# EAGLE design AMS Test Board rev2 (EAGLE 9.6.2)

## Sheet 1 of 2
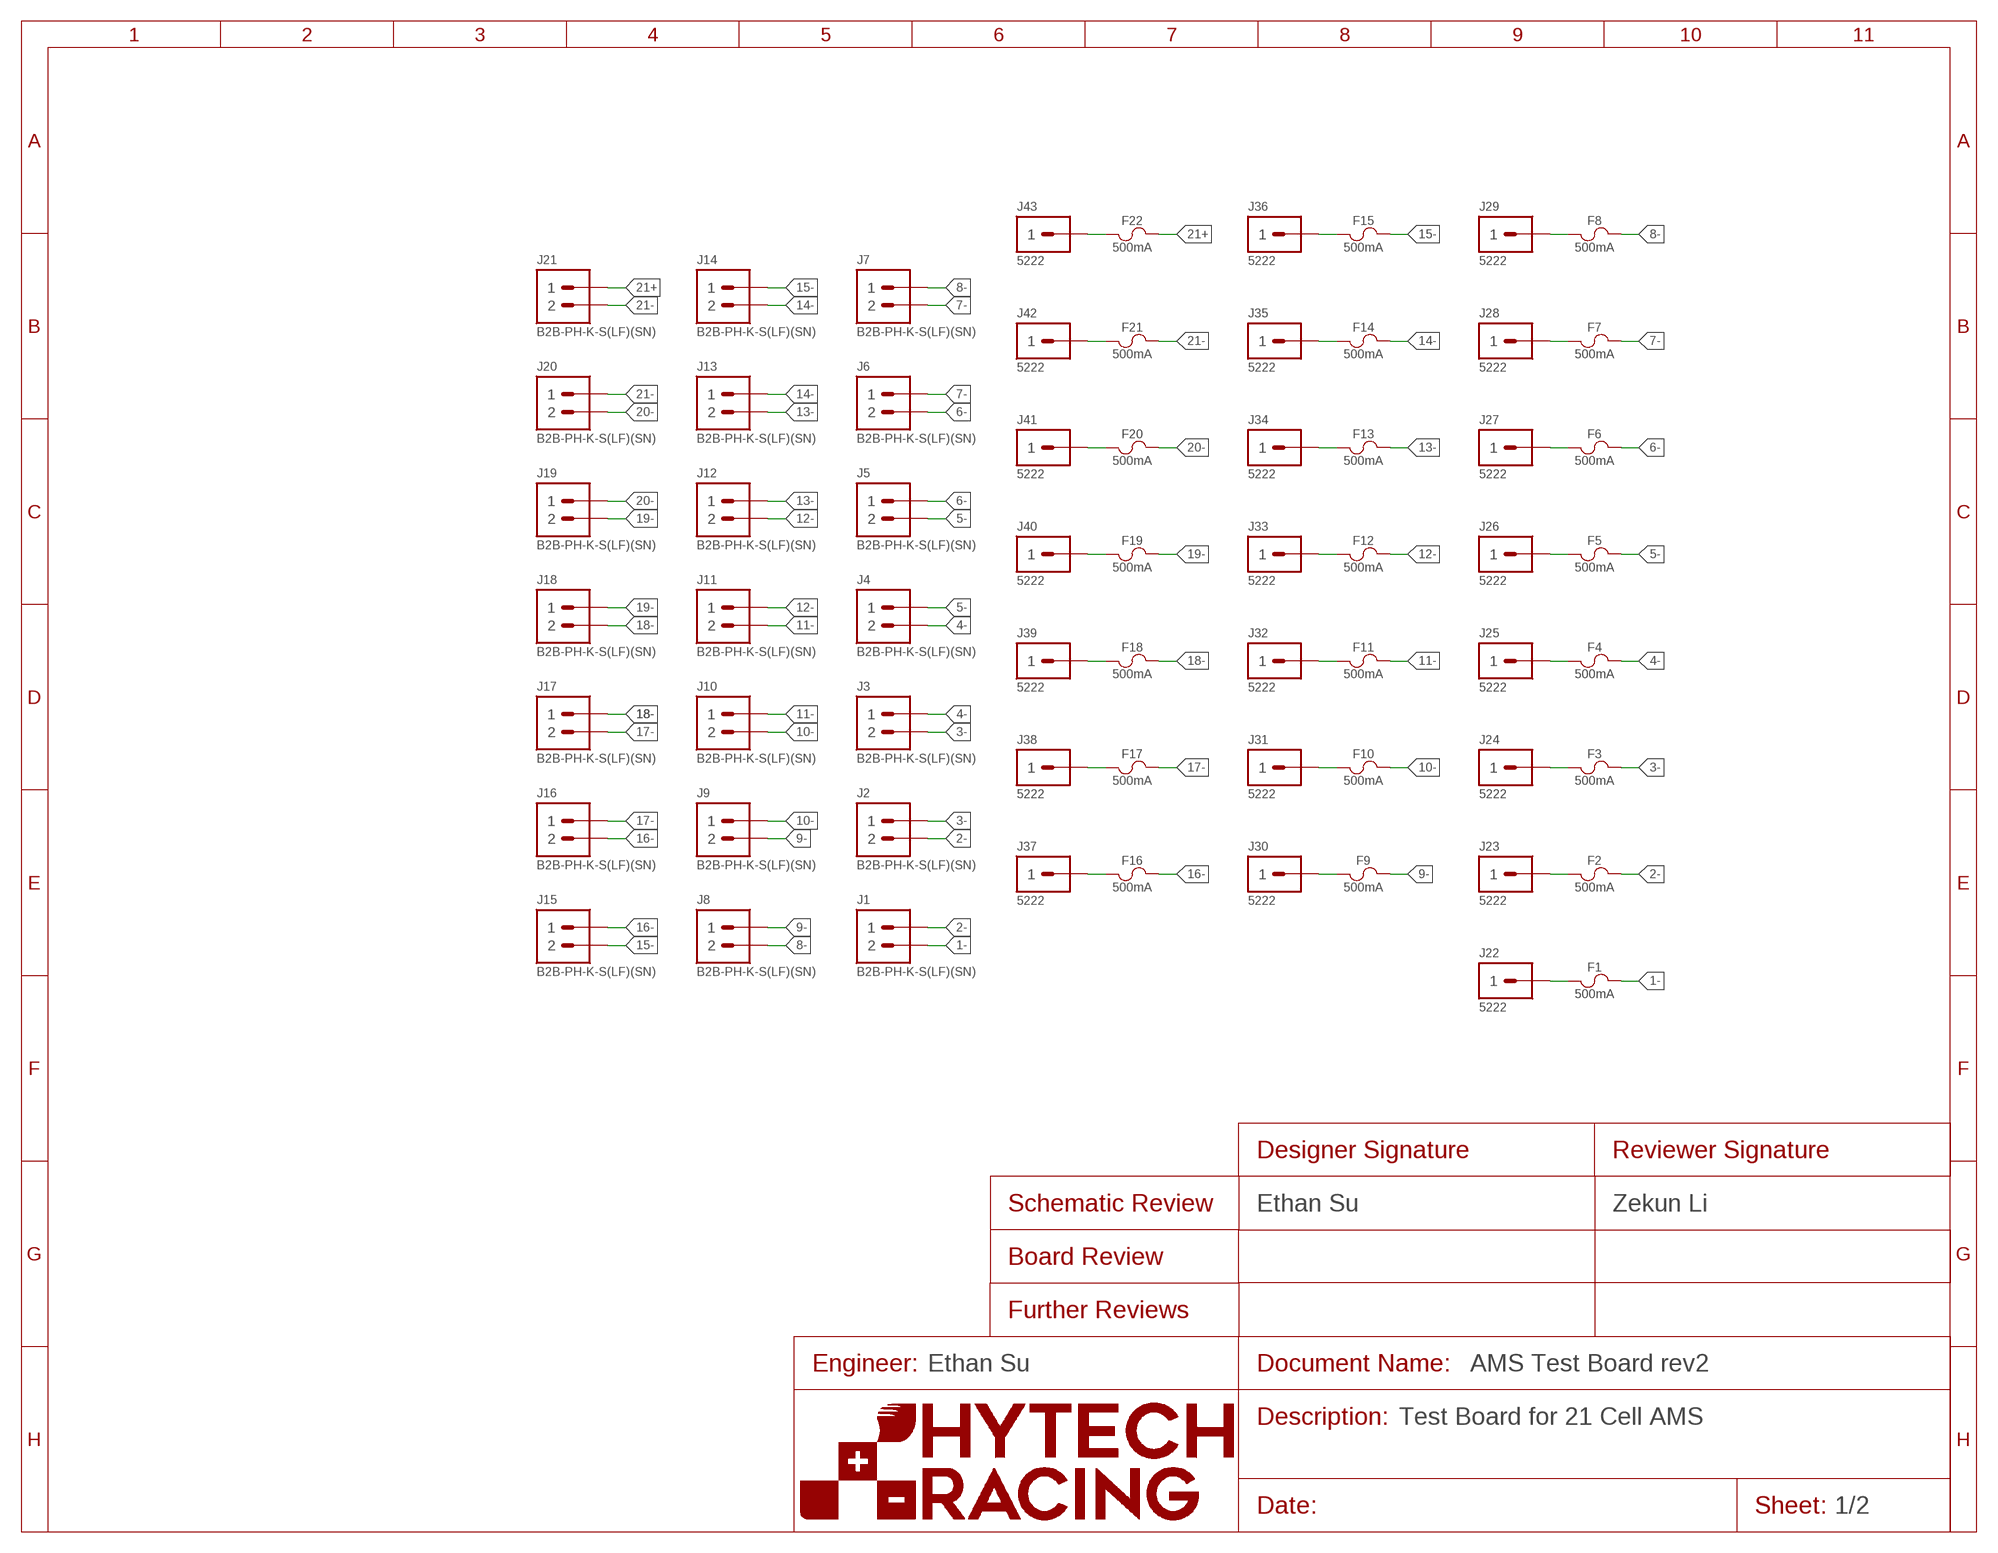
[diagram p0: schematic, sheet 1]
FRAME1 (FRAME): DESCRIPTION_1: Test Board for 21 Cell AMS; DESIGNER_SCHEMATIC: Ethan Su; ENGINEER: Ethan Su; REVIEWER_SCHEMATIC: Zekun Li

### Parts
F1  FUSE_OMF_125_.5A  [OMF_125]
F2  FUSE_OMF_125_.5A  [OMF_125]
F3  FUSE_OMF_125_.5A  [OMF_125]
F4  FUSE_OMF_125_.5A  [OMF_125]
F5  FUSE_OMF_125_.5A  [OMF_125]
F6  FUSE_OMF_125_.5A  [OMF_125]
F7  FUSE_OMF_125_.5A  [OMF_125]
F8  FUSE_OMF_125_.5A  [OMF_125]
F9  FUSE_OMF_125_.5A  [OMF_125]
F10  FUSE_OMF_125_.5A  [OMF_125]
F11  FUSE_OMF_125_.5A  [OMF_125]
F12  FUSE_OMF_125_.5A  [OMF_125]
F13  FUSE_OMF_125_.5A  [OMF_125]
F14  FUSE_OMF_125_.5A  [OMF_125]
F15  FUSE_OMF_125_.5A  [OMF_125]
F16  FUSE_OMF_125_.5A  [OMF_125]
F17  FUSE_OMF_125_.5A  [OMF_125]
F18  FUSE_OMF_125_.5A  [OMF_125]
F19  FUSE_OMF_125_.5A  [OMF_125]
F20  FUSE_OMF_125_.5A  [OMF_125]
F21  FUSE_OMF_125_.5A  [OMF_125]
F22  FUSE_OMF_125_.5A  [OMF_125]
J1  CONNECTOR-2__B2B-PH-K  [B2B-PH-K]
J2  CONNECTOR-2__B2B-PH-K  [B2B-PH-K]
J3  CONNECTOR-2__B2B-PH-K  [B2B-PH-K]
J4  CONNECTOR-2__B2B-PH-K  [B2B-PH-K]
J5  CONNECTOR-2__B2B-PH-K  [B2B-PH-K]
J6  CONNECTOR-2__B2B-PH-K  [B2B-PH-K]
J7  CONNECTOR-2__B2B-PH-K  [B2B-PH-K]
J8  CONNECTOR-2__B2B-PH-K  [B2B-PH-K]
J9  CONNECTOR-2__B2B-PH-K  [B2B-PH-K]
J10  CONNECTOR-2__B2B-PH-K  [B2B-PH-K]
J11  CONNECTOR-2__B2B-PH-K  [B2B-PH-K]
J12  CONNECTOR-2__B2B-PH-K  [B2B-PH-K]
J13  CONNECTOR-2__B2B-PH-K  [B2B-PH-K]
J14  CONNECTOR-2__B2B-PH-K  [B2B-PH-K]
J15  CONNECTOR-2__B2B-PH-K  [B2B-PH-K]
J16  CONNECTOR-2__B2B-PH-K  [B2B-PH-K]
J17  CONNECTOR-2__B2B-PH-K  [B2B-PH-K]
J18  CONNECTOR-2__B2B-PH-K  [B2B-PH-K]
J19  CONNECTOR-2__B2B-PH-K  [B2B-PH-K]
J20  CONNECTOR-2__B2B-PH-K  [B2B-PH-K]
J21  CONNECTOR-2__B2B-PH-K  [B2B-PH-K]
J22  CONNECTOR-1_5222  [5222]
J23  CONNECTOR-1_5222  [5222]
J24  CONNECTOR-1_5222  [5222]
J25  CONNECTOR-1_5222  [5222]
J26  CONNECTOR-1_5222  [5222]
J27  CONNECTOR-1_5222  [5222]
J28  CONNECTOR-1_5222  [5222]
J29  CONNECTOR-1_5222  [5222]
J30  CONNECTOR-1_5222  [5222]
J31  CONNECTOR-1_5222  [5222]
J32  CONNECTOR-1_5222  [5222]
J33  CONNECTOR-1_5222  [5222]
J34  CONNECTOR-1_5222  [5222]
J35  CONNECTOR-1_5222  [5222]
J36  CONNECTOR-1_5222  [5222]
J37  CONNECTOR-1_5222  [5222]
J38  CONNECTOR-1_5222  [5222]
J39  CONNECTOR-1_5222  [5222]
J40  CONNECTOR-1_5222  [5222]
J41  CONNECTOR-1_5222  [5222]
J42  CONNECTOR-1_5222  [5222]
J43  CONNECTOR-1_5222  [5222]

### Nets
1-: F1.2 J1.2
2-: F2.2 J1.1 J2.2
3-: F3.2 J2.1 J3.2
4-: F4.2 J3.1 J4.2
5-: F5.2 J4.1 J5.2
6-: F6.2 J5.1 J6.2
7-: F7.2 J6.1 J7.2
8-: F8.2 J7.1 J8.2
9-: F9.2 J8.1 J9.2
10-: F10.2 J9.1 J10.2
11-: F11.2 J10.1 J11.2
12-: F12.2 J11.1 J12.2
13-: F13.2 J12.1 J13.2
14-: F14.2 J13.1 J14.2
15-: F15.2 J14.1 J15.2
16-: F16.2 J15.1 J16.2
17-: F17.2 J16.1 J17.2
18-: F18.2 J17.1 J18.2
19-: F19.2 J18.1 J19.2
20-: F20.2 J19.1 J20.2
21+: F22.2 J21.1
21-: F21.2 J20.1 J21.2
N$1: F1.1 J22.1
N$2: F2.1 J23.1
N$3: F3.1 J24.1
N$4: F4.1 J25.1
N$5: F5.1 J26.1
N$6: F6.1 J27.1
N$7: F7.1 J28.1
N$8: F8.1 J29.1
N$9: F9.1 J30.1
N$10: F10.1 J31.1
N$11: F11.1 J32.1
N$12: F12.1 J33.1
N$13: F13.1 J34.1
N$14: F14.1 J35.1
N$15: F15.1 J36.1
N$16: F16.1 J37.1
N$17: F17.1 J38.1
N$18: F18.1 J39.1
N$19: F19.1 J40.1
N$20: F20.1 J41.1
N$21: F21.1 J42.1
N$22: F22.1 J43.1

## Sheet 2 of 2
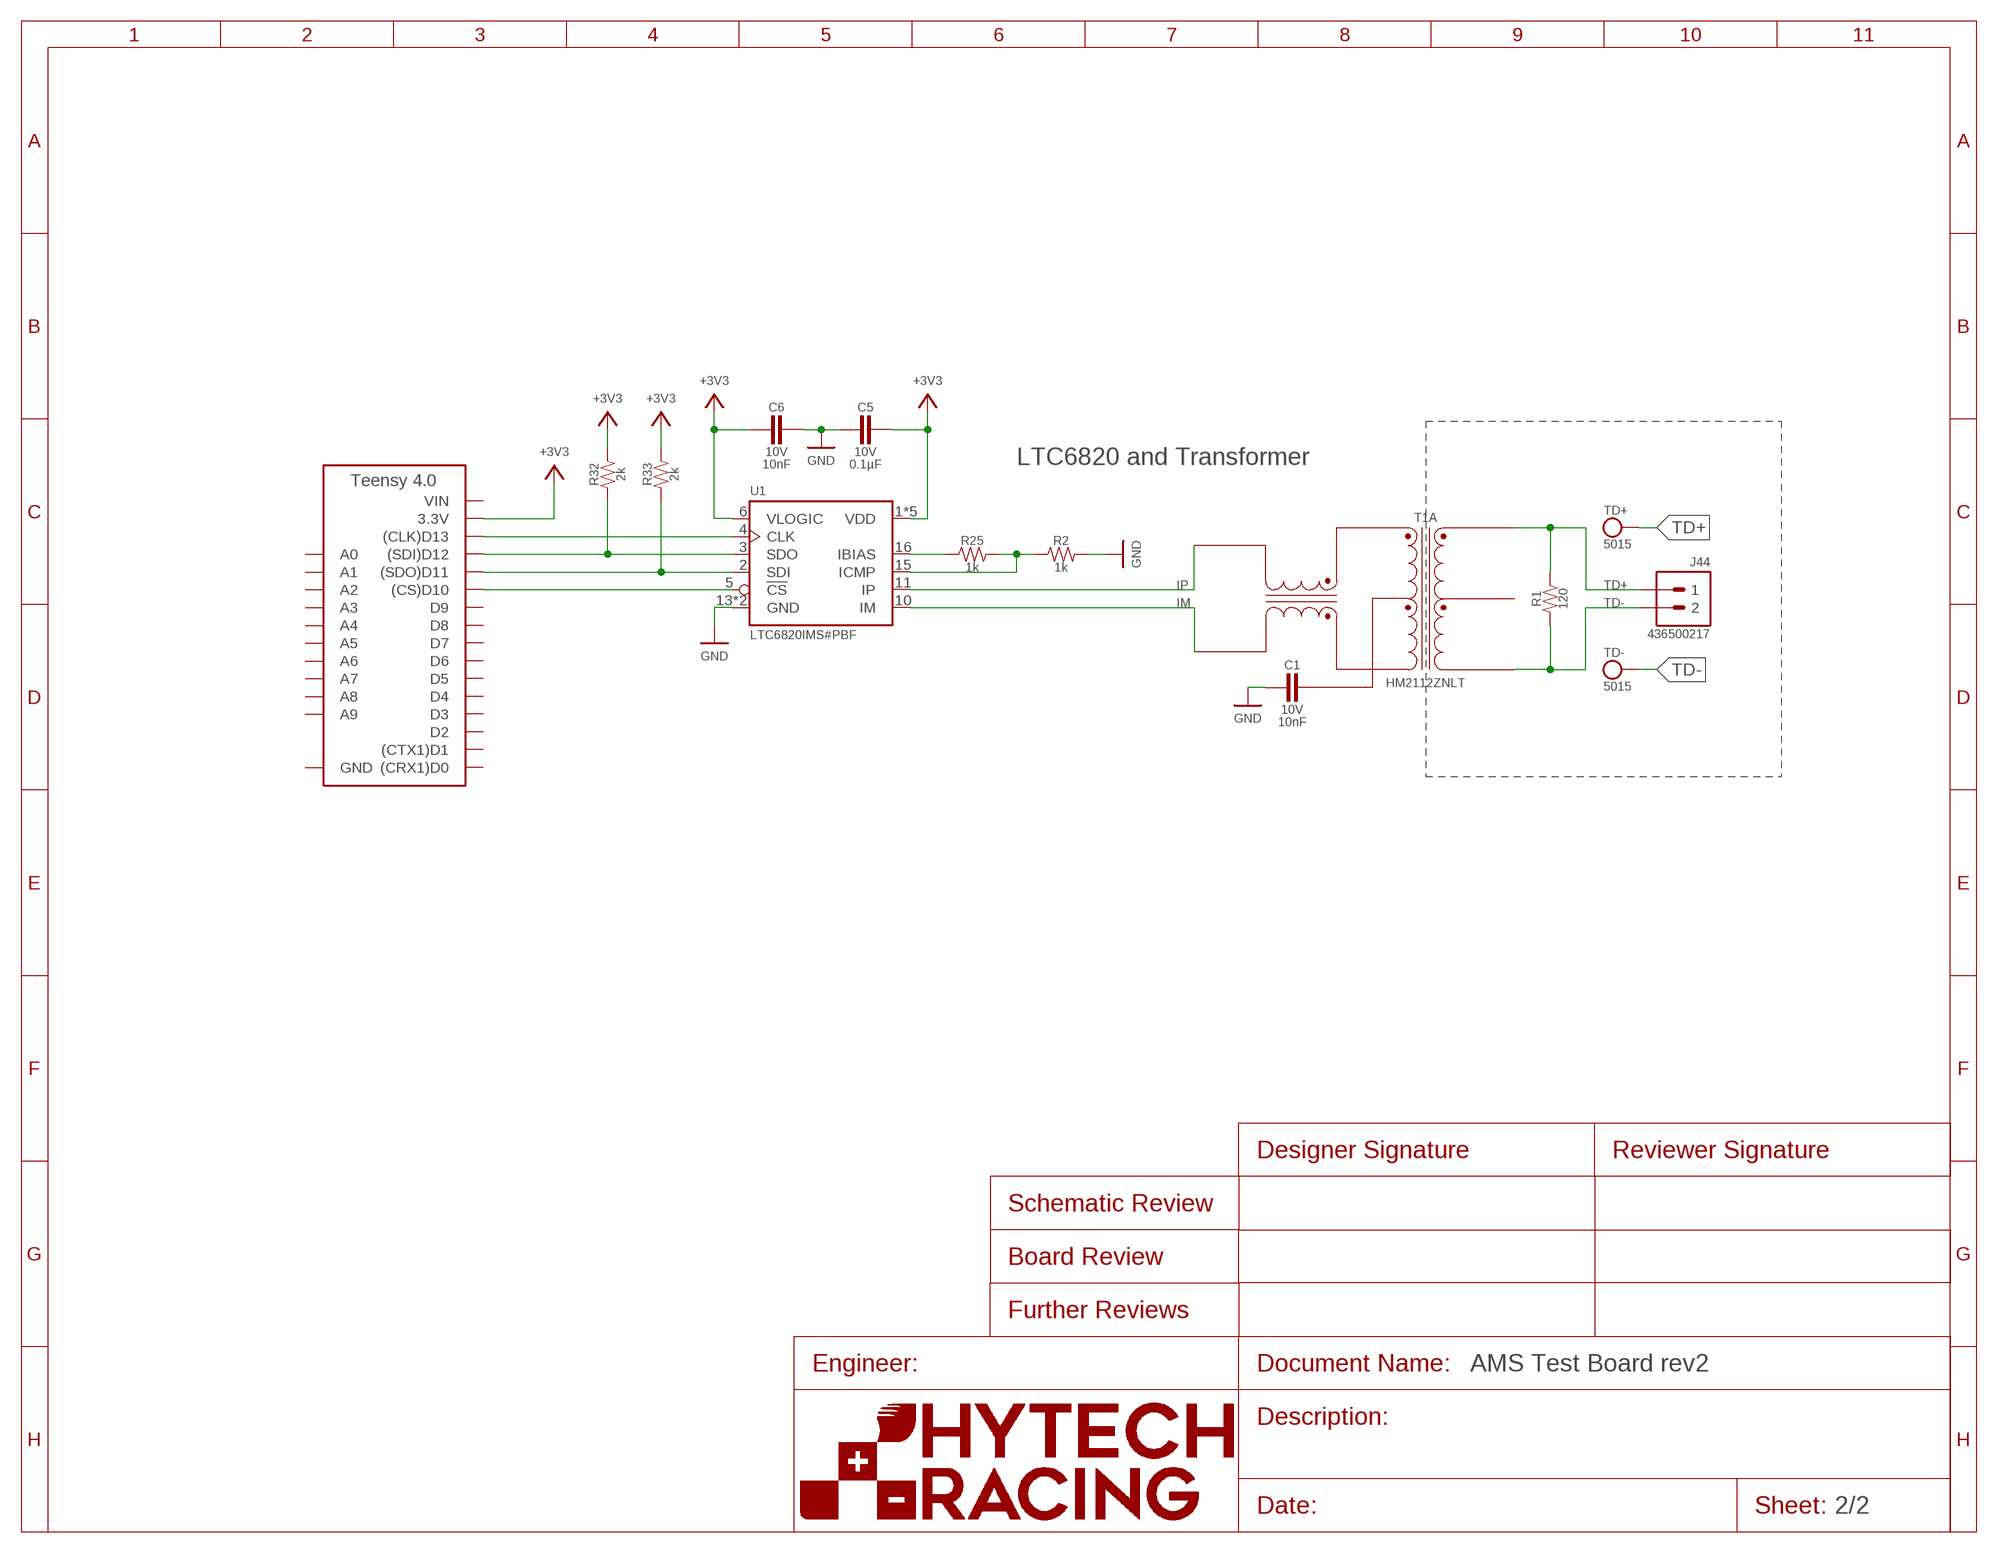
[diagram p1: schematic, sheet 2]

### Parts
A1  TEENSY_4.0  [TEENSY_SHORT]
C1  CAPACITOR_0603_10V_10NF  [0603-CAP]
C5  CAPACITOR_0603_10V_0.1UF  [0603-CAP]
C6  CAPACITOR_0603_10V_10NF  [0603-CAP]
J44  CONNECTOR-2_MF_T_V_  [MOLEX_MICROFIT_PTH_VERTICAL_02_SINGLE]
R1  RESISTOR_0603_120  [0603-RES]
R2  RESISTOR_0603_1K  [0603-RES]
R25  RESISTOR_0603_1K  [0603-RES]
R32  RESISTOR_0603_2K  [0603-RES]
R33  RESISTOR_0603_2K  [0603-RES]
T1  TRANSFORMER_HM2112ZNLT_AIRGAP  [HM2112ZNLT_AIRGAP]
TD+  TEST_POINT  [MICRO_MINIATURE]
TD-  TEST_POINT  [MICRO_MINIATURE]
U1  LTC6820  [MSOP-16]

### Nets
+3V3: A1.3.3V C5.1 C6.2 R32.2 R33.2 U1.1(VDD) U1.6(VLOGIC) U1.7(VDD) U1.8(VDD) U1.9(VDD) U1.12(VDD)
GND: C1.2 C5.2 C6.1 R2.2 U1.13(GND) U1.14(GND)
IM: T1.10(A:TD-) U1.10(IM)
IP: T1.12(A:TD+) U1.11(IP)
N$23: C1.1 T1.11(A:TCT)
N$24: A1.D13((CLK)D13) U1.4(CLK)
N$25: A1.D12((SDI)D12) R32.1 U1.3(SDO)
N$26: A1.D11((SDO)D11) R33.1 U1.2(SDI)
N$27: A1.D10((CS)D10) U1.5(!CS)
N$30: R25.1 U1.16(IBIAS)
N$31: R2.1 R25.2 U1.15(ICMP)
TD+: J44.1 R1.2 T1.1(A:MX+) TD+.1
TD-: J44.2 R1.1 T1.3(A:MX-) TD-.1
Unconnected: A1.D0((CRX1)D0) A1.D1((CTX1)D1) A1.D2 A1.D3 A1.D4 A1.D5 A1.D6 A1.D7 A1.D8 A1.D9 A1.D14(A0) A1.D15(A1) A1.D16(A2) A1.D17(A3) A1.D18(A4) A1.D19(A5) A1.D20(A6) A1.D21(A7) A1.D22(A8) A1.D23(A9) T1.2(A:MCT) T1.4(B:MX+) T1.5(B:MCT) T1.6(B:MX-) T1.7(B:TD-) T1.8(B:TCT) T1.9(B:TD+)

### Notes on the sheet
- LTC6820 and Transformer

## Power pins joined to a net without a drawn wire
GND: A1.AGND/GND(GND) A1.GND
VIN: A1.VIN

## Library data of the parts
A1 = HyTechDevices:TEENSY_4.0: Teensy 4.0 Datasheet <https://www.pjrc.com/store/teensy40.html> Requires ordering of: 2: 14 pin, 0.1" pitch female headers; TEENSY: 4.0
C1 = HyTechDevices - Copy:CAPACITOR_?_*: Capacitor, Non-Polarized; CAPACITANCE: 10nF; DKPN: 311-4054-1-ND; MANUFACTURER: Yageo; MOPN: 603-CC603KRX7R6BB103; MPN: CC0603KRX7R6BB103; TOLERANCE: 10%; VOLTAGE: 10V
C5 = HyTechDevices:CAPACITOR_?_*: Capacitor, Non-Polarized; CAPACITANCE: 0.1µF; DKPN: 720-1688-1-ND; MANUFACTURER: Vishay Vitramon; MOPN: 77-VJ0603Y104JXQPBC; MPN: VJ0603Y104JXQPW1BC; TOLERANCE: 5%; VOLTAGE: 10V
C6 = HyTechDevices:CAPACITOR_?_*: Capacitor, Non-Polarized; CAPACITANCE: 10nF; DKPN: 311-4054-1-ND; MANUFACTURER: Yageo; MOPN: 603-CC603KRX7R6BB103; MPN: CC0603KRX7R6BB103; TOLERANCE: 10%; VOLTAGE: 10V
F1-F22 = HyTechDevices:FUSE_?_*: Fuse 885 Series <https://www.mouser.com/datasheet/2/240/Littelfuse_Fuse_885_Datasheet_pdf-1371443.pdf> MST 250 Series <https://www.mouser.com/datasheet/2/358/typ_MST_250-1772502.pdf> OMF 125 Series <https://www.mouser.com/datasheet/2/358/typ_OMF_125-1275954.pdf> 0686F0750-01 <https://www.mouser.com/datasheet/2/643/ds-CP-c2f-series-1291054.pdf>; CURRENT: 500mA; DKPN: 486-3694-ND; FUSE_TYPE: SMD; I2T: 0.01; MANUFACTURER: Schurter Inc.; MOPN: 693-3404.0045.11; MPN: 3404.0045.11; VOLTAGE: 125V
J1-J21 = HyTechDevices:CONNECTOR-2_?_*: 2 Pin Connector; DKPN: 455-1704-ND; MANUFACTURER: JST Sales America Inc.; MPN: B2B-PH-K-S(LF)(SN); NWRKPN: 37K9940
J22-J43 = HyTechDevices:CONNECTOR-1_?: 1 Pin Connector Pogo pin datasheet <https://www.mouser.com/datasheet/2/273/Mill-Max_03212019_807-22-001-10-020101-1545127.pdf> 5222 Spring datasheet <https://www.mouser.com/datasheet/2/215/5222-743174.pdf>; DKPN: 36-5222-ND; MANUFACTURER: Keystone Electronics; MODEL: SPRING; MOPN: 534-5222; MPN: 5222
J44 = HyTechDevices - Copy:CONNECTOR-2_?_*: 2 Pin Connector; MANUFACTURER: MOLEX; MPN: 436500217
R1 = HyTechDevices:RESISTOR_?_*: Resistor; DKPN: P120DBCT-ND; MANUFACTURER: Panasonic Electronic Components; MOPN: 667-ERA-3AEB121V; MPN: ERA-3AEB121V; POWER: 0.1W; RESISTANCE: 120; TOLERANCE: 0.1%; VOLTAGE_CONTINUOUS: 3.46V; VOLTAGE_MAX: 75V
R2 R25 = HyTechDevices - Copy:RESISTOR_?_*: Resistor; DKPN: 311-1.00KHRCT-ND; MANUFACTURER: Yageo; MOPN: 603-RC0603FR-071KL; MPN: RC0603FR-071KL; POWER: 0.1W; RESISTANCE: 1k; TOLERANCE: 1%; VOLTAGE_CONTINUOUS: 10.00V; VOLTAGE_MAX: 75V
R32 R33 = HyTechDevices:RESISTOR_?_*: Resistor; DKPN: 10-ERJ-UP3F2001VTR-ND; MANUFACTURER: Panasonic Electronic Components; MOPN: 667-ERJ-UP3F2001V; MPN: ERJ-UP3F2001V; POWER: 0.25W; RESISTANCE: 2k; TOLERANCE: 1%; VOLTAGE_CONTINUOUS: 22.36V; VOLTAGE_MAX: 150V
T1 = HyTechDevices:TRANSFORMER: 2 Channel SMT Transformer Specs for both HM2102NL and HM2112ZNL Transformers Turns ratio: 1CT: 1CT Isolation Voltage: 4300 VDC Inductance: 150 uH Leakage Inductance: 0.50 uH max HM2102NLT: Datasheet <https://www.mouser.com/datasheet/2/336/HM2102NL-1218600.pdf> HM2112ZNLT: Datasheet <https://www.mouser.com/datasheet/2/336/HM2112ZNL-1224892.pdf>; DKPN: 1840-1036-1-ND; MANUFACTURER: Pulse Electronics; MOPN: 673-HM2112ZNLT; MPN: HM2112ZNLT
TD+ TD- = HyTechDevices - Copy:TEST_POINT: Test Point; DKPN: 36-5015CT-ND; MANUFACTURER: Keystone Electronics; MOPN: 534-5015; MPN: 5015
U1 = HyTechDevices:LTC6820: LTC6820 isoSPI Isolated Communications Interface Datasheet <mouser.com/datasheet/2/609/LTC6820-1601976.pdf>; MANUFACTURER: Analog Devices; MPN: LTC6820IMS#PBF

## Board
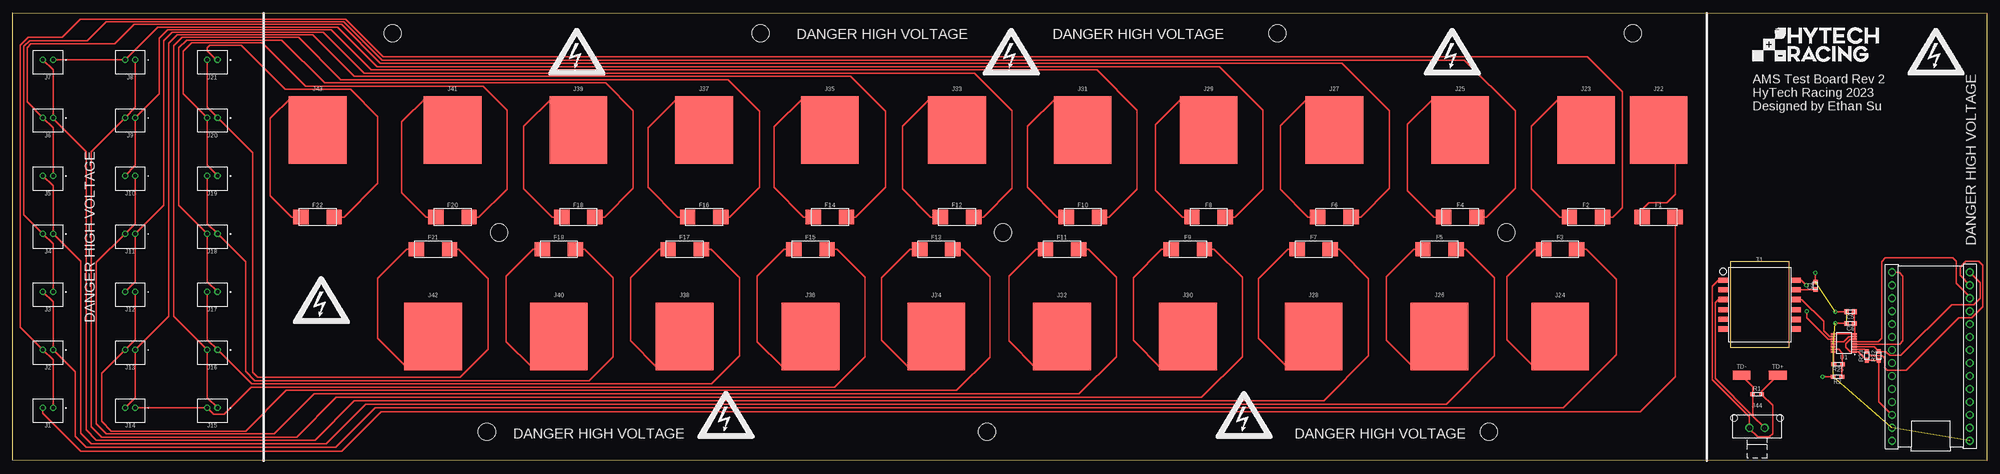
[diagram p2: board, top side]
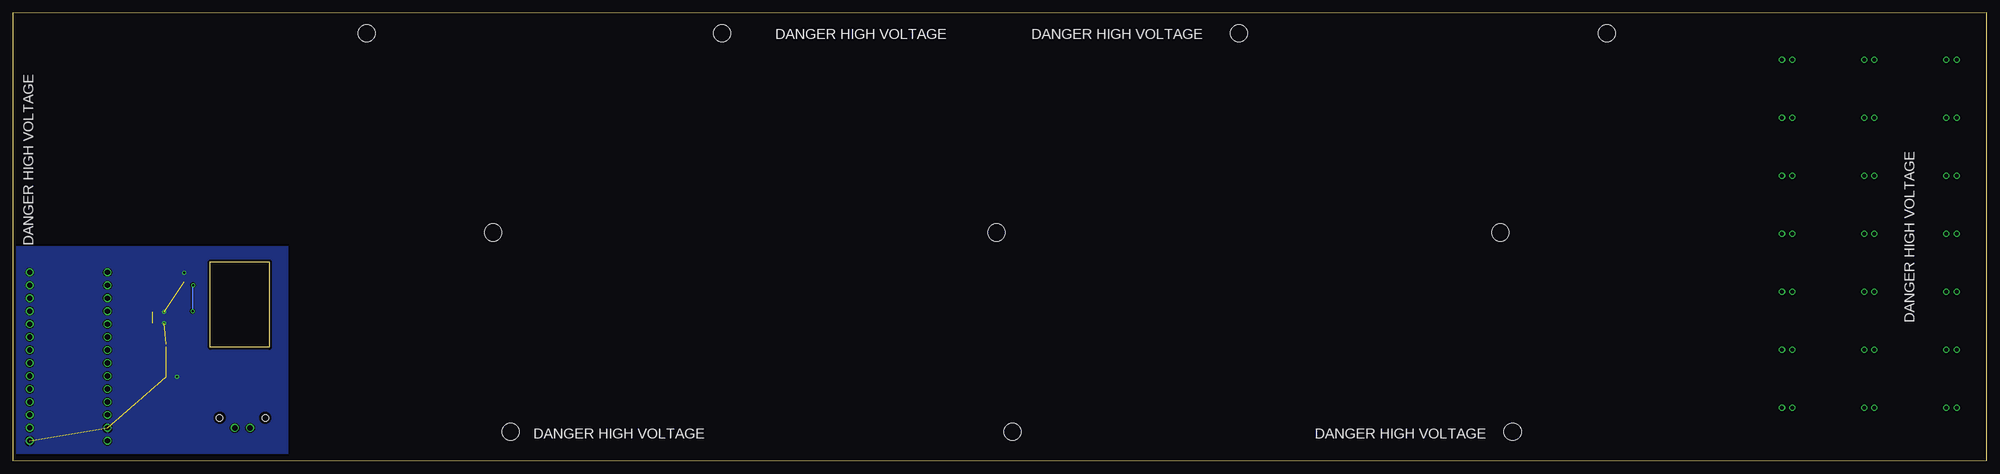
[diagram p3: board, bottom side, seen from below]

Size 386.61 x 87.73 mm. Coordinates in mm from the lower left corner, seen from the top.
Outline: 0,0.1 0,87.73 386.61,87.63 386.61,0 0,0.1
Copper layers (1*16): Top 0.035mm / dielectric 1.53mm / Bottom 0.035mm
Design rules "HyTech Default (2 Layer)": minimum track width 6mil, minimum drill 14mil, track to track 6mil, track to pad 6mil, pad to pad 6mil, via to via 20mil, smd to smd 6mil, copper to edge 20mil, drill to drill 21mil, minimum pad ring 7mil, minimum via ring 8mil, stop-mask expansion 6mil, vias tented up to drill 30mil, thermal gap 10mil

### Footprints (pad centres in the part's own frame; a part is rotated, then mirrored left to right if it is on the bottom)
TEENSY_SHORT = drill 1.016: 3.3V 0,5.08; AGND/GND 0,2.54; D0 15.24,2.54; D1 15.24,5.08; D2 15.24,7.62; D3 15.24,10.16; D4 15.24,12.7; D5 15.24,15.24; D6 15.24,17.78; D7 15.24,20.32; D8 15.24,22.86; D9 15.24,25.4; D10 15.24,27.94; D11 15.24,30.48; D12 15.24,33.02; D13 0,33.02; D14 0,30.48; D15 0,27.94; D16 0,25.4; D17 0,22.86; D18 0,20.32; D19 0,17.78; D20 0,15.24; D21 0,12.7; D22 0,10.16; D23 0,7.62; GND 15.24,0; VIN 0,0
0603-CAP = smd 0.9 x 0.9: 1 -0.75,0; 2 0.75,0
OMF_125 = smd 3 x 2.8: 1 -3.25,0; 2 3.25,0
B2B-PH-K = drill 0.8: 1 -1,-0.55; 2 1,-0.55
5222 = smd 11.303 x 13.208: 1 0,0
MOLEX_MICROFIT_PTH_VERTICAL_02_SINGLE = drill 1.067: 1 1.499,0; 2 -1.499,0 | hole 1.321: 4.496,-1.956; -4.496,-1.956
0603-RES = smd 0.9 x 0.8: 1 -0.85,0; 2 0.85,0
HM2112ZNLT_AIRGAP = smd 1.02 x 1.89: 1 -4.78,-7.145; 2 -2.89,-7.145; 3 -1,-7.145; 4 1,-7.145; 5 2.875,-7.145; 6 4.78,-7.145; 7 4.78,7.145; 8 2.89,7.145; 9 1,7.145; 10 -1,7.145; 11 -2.89,7.145; 12 -4.78,7.145
MICRO_MINIATURE = smd 3.429 x 1.778: 1 0,0
MSOP-16 = smd 0.305 x 0.889: 1 -1.75,-2.106; 2 -1.25,-2.106; 3 -0.75,-2.106; 4 -0.25,-2.106; 5 0.25,-2.106; 6 0.75,-2.106; 7 1.25,-2.106; 8 1.75,-2.106; 9 1.75,2.106; 10 1.25,2.106; 11 0.75,2.106; 12 0.25,2.106; 13 -0.25,2.106; 14 -0.75,2.106; 15 -1.25,2.106; 16 -1.75,2.106
MOUNTING_M3 = hole 3.4: 0,0

### Placement (x,y rotation side)
A1  368.05,3.91 0 top
C1  353.06,34.26 90 top
C5  359.92,29.18 180 top
C6  359.92,26.9 0 top
F1  322.35,47.73 0 top
F2  308.13,47.73 0 top
F3  303.05,41.43 0 top
F4  283.49,47.73 0 top
F5  279.43,41.43 0 top
F6  258.85,47.73 0 top
F7  254.79,41.43 0 top
F8  234.21,47.73 0 top
F9  230.15,41.43 0 top
F10  209.58,47.73 0 top
F11  205.51,41.43 0 top
F12  184.94,47.73 0 top
F13  180.87,41.43 0 top
F14  160.05,47.73 0 top
F15  156.24,41.43 0 top
F16  135.41,47.73 0 top
F17  131.6,41.43 0 top
F18  110.77,47.73 0 top
F19  106.96,41.43 0 top
F20  86.13,47.73 0 top
F21  82.32,41.43 0 top
F22  59.72,47.73 0 top
J1  6.9,9.84 180 top
J2  6.9,21.2 180 top
J3  6.9,32.56 180 top
J4  6.9,43.92 180 top
J5  6.9,55.28 180 top
J6  6.9,66.64 180 top
J7  6.9,78 180 top
J8  23,78 180 top
J9  23,66.64 180 top
J10  23,55.28 180 top
J11  23,43.92 180 top
J12  23,32.56 180 top
J13  23,21.2 180 top
J14  23,9.84 180 top
J15  39.1,9.84 180 top
J16  39.1,21.2 180 top
J17  39.1,32.56 180 top
J18  39.1,43.92 180 top
J19  39.1,55.28 180 top
J20  39.1,66.64 180 top
J21  39.1,78 180 top
J22  322.35,64.77 0 top
J23  308.13,64.77 0 top
J24  303.05,24.38 0 top
J25  283.49,64.77 0 top
J26  279.43,24.38 0 top
J27  258.85,64.77 0 top
J28  254.79,24.38 0 top
J29  234.21,64.77 0 top
J30  230.15,24.38 0 top
J31  209.58,64.77 0 top
J32  205.51,24.38 0 top
J33  184.94,64.77 0 top
J34  180.87,24.38 0 top
J35  160.05,64.77 0 top
J36  156.24,24.38 0 top
J37  135.41,64.77 0 top
J38  131.6,24.38 0 top
J39  110.77,64.77 0 top
J40  106.96,24.38 0 top
J41  86.13,64.77 0 top
J42  82.32,24.38 0 top
J43  59.72,64.77 0 top
J44  341.63,6.45 180 top
R1  341.63,13.06 0 top
R2  357.38,16.48 180 top
R25  357.5,18.9 0 top
R32  365.51,20.55 270 top
R33  363.09,20.55 270 top
T1  342.14,30.58 270 top
TD+  345.69,16.74 0 top
TD-  338.58,16.74 0 top
U1  358.65,23.09 90 top
U$1  [MOUNTING_M3]  74.37,83.69 0 top
U$2  [MOUNTING_M3]  146.46,83.69 0 top
U$3  [MOUNTING_M3]  247.68,83.69 0 top
U$4  [MOUNTING_M3]  317.32,83.69 0 top
U$5  [HV_LARGE]  60.45,31.47 0 top
U$7  [HV_LARGE]  376.68,80.11 0 top
U$8  [HV_LARGE]  139.7,8.99 0 top
U$9  [HV_LARGE]  241.17,8.99 0 top
U$10  [HV_LARGE]  281.94,80.11 0 top
U$11  [HV_LARGE]  195.58,80.11 0 top
U$12  [HV_LARGE]  110.49,80.11 0 top
U$13  [DANGER_HIGH_VOLTAGE]  114.81,5.31 0 top
U$14  [DANGER_HIGH_VOLTAGE]  267.84,5.31 0 top
U$15  [DANGER_HIGH_VOLTAGE]  170.31,83.54 0 top
U$16  [DANGER_HIGH_VOLTAGE]  220.47,83.54 0 top
U$17  [DANGER_HIGH_VOLTAGE]  383.54,58.98 90 top
U$18  [DANGER_HIGH_VOLTAGE]  15.11,43.87 90 top
U$19  [LOGO_HYTECH_MEDIUM]  340.61,78.21 0 top
U$20  [MOUNTING_M3]  95.28,44.7 0 top
U$21  [MOUNTING_M3]  193.95,44.7 0 top
U$22  [MOUNTING_M3]  292.51,44.7 0 top
U$29  [MOUNTING_M3]  92.86,5.72 0 top
U$30  [MOUNTING_M3]  190.78,5.72 0 top
U$31  [MOUNTING_M3]  289.08,5.72 0 top

### Tracks (layer width: path | path; a pad name or v marks a point on that pad's centre or on a via)
1-
  Top 0.254: F1.2 325.63,47.7 325.63,16.48 318.77,9.63 72.14,9.63 64.39,1.88 13.31,1.88 5.9,9.29 J1.2
2-
  Top 0.254: J1.1 7.9,17.37 7.9,18.65 7.9,19.75 J2.2 1.5,26.15 1.5,81.36 3.05,82.91 9.67,82.91 13.21,86.45 65.17,86.45 72.52,79.1 308.36,79.1 315.21,72.24 315.21,49.53 313.41,47.73 F2.2
3-
  Top 0.254: F3.2 308.2,41.43 314.07,35.56 314.07,20.8 303.66,10.39 70.99,10.39 63.25,2.64 14.35,2.64 12.19,4.79 12.19,15.21 12.19,16.35 12.19,17.45 J2.1 7.9,31.11 J3.2
4-
  Top 0.254: J3.1 7.9,40.11 7.9,41.37 7.9,42.47 J4.2 2.16,48.21 2.16,81.13 3.3,82.27 14.61,82.27 18.29,85.95 64.84,85.95 72.33,78.46 284.35,78.46 294.26,68.55 294.26,53.34 288.64,47.73 F4.2
5-
  Top 0.254: F5.2 284.58,41.43 290.19,35.81 290.19,20.55 280.75,11.1 69.1,11.1 61.38,3.38 15.33,3.38 13.31,5.39 13.31,37.06 13.31,37.96 13.31,39.06 J4.1 7.9,53.83 J5.2
6-
  Top 0.254: F6.2 264.01,47.73 269.62,53.34 269.62,68.55 260.32,77.85 71.98,77.85 64.39,85.45 23.75,85.45 19.94,81.64 3.56,81.64 2.79,80.87 2.79,70.29 J6.2 7.9,65.19 7.9,64.09 7.9,62.84 J5.1
7-
  Top 0.254: F7.2 259.81,41.43 265.56,35.69 265.56,20.55 256.77,11.76 66.9,11.76 59.18,4.04 16.38,4.04 14.35,6.07 14.35,60.52 7.9,66.98 J6.1 7.9,76.55 J7.2
8-
  Top 0.254: J7.1 J8.2 28.39,84.94 29.49,84.94 29.84,84.94 63.63,84.94 71.37,77.19 236.35,77.19 244.86,68.68 244.86,53.21 239.37,47.73 F8.2
9-
  Top 0.254: J8.1 24,69.19 J9.2 15.34,60.53 15.34,59.43 15.34,58.39 15.34,6.66 17.38,4.62 55.58,4.62 63.37,12.42 232.79,12.42 240.79,20.42 240.79,35.94 235.3,41.43 F9.2
10-
  Top 0.254: F10.2 214.73,47.73 220.22,53.21 220.22,68.68 212.34,76.56 70.23,76.56 62.36,84.43 30.35,84.43 28.7,82.78 28.7,72.49 28.7,71.89 J9.1 24,57.83 J10.2
11-
  Top 0.254: J10.1 24,46.47 J11.2 16.38,38.85 16.38,37.75 16.38,36.42 16.38,7.21 18.31,5.28 51.16,5.28 59,13.13 208.86,13.13 216.15,20.42 216.15,35.94 210.67,41.43 F11.2
12-
  Top 0.254: F12.2 190.09,47.73 195.71,53.34 195.71,68.55 188.34,75.92 68.83,75.92 60.83,83.92 31.24,83.92 29.59,82.27 29.59,50.27 29.59,50.06 J11.1 24,35.11 J12.2
13-
  Top 0.254: J12.1 24,23.75 J13.2 17.4,17.15 17.4,16.05 17.4,15.34 17.4,7.72 19.3,5.82 45.59,5.82 53.57,13.79 184.89,13.79 191.39,20.29 191.39,36.07 186.03,41.43 F13.2
14-
  Top 0.254: F14.2 165.07,47.73 170.94,53.6 170.94,68.43 164.08,75.29 66.87,75.29 58.72,83.44 32.22,83.44 30.58,81.8 30.58,28.68 30.58,28.33 J13.1 24,12.39 J14.2
15-
  Top 0.254: J14.1 J15.2 39.35,9.14 41.42,9.14 46.74,14.45 160.91,14.45 166.88,20.42 166.88,35.94 161.39,41.43 F15.2
16-
  Top 0.254: F16.2 140.44,47.73 146.3,53.6 146.3,68.43 140.08,74.65 64.26,74.65 56.01,82.91 33.15,82.91 31.5,81.25 31.5,30.45 31.5,28.35 J16.2 38.1,12.39 J15.1
17-
  Top 0.254: J17.2 38.1,23.75 J16.1 46.76,15.09 47.31,15.09 136.91,15.09 142.37,20.55 142.37,35.81 136.75,41.43 F17.2
18-
  Top 0.254: F18.2 115.92,47.73 121.54,53.34 121.54,68.55 116.08,74.02 61.09,74.02 52.7,82.4 34.04,82.4 32.51,80.87 32.51,51.79 32.51,50.05 J18.2 38.1,35.11 J17.1
19-
  Top 0.254: F19.2 111.99,41.43 117.6,35.81 117.6,20.42 112.9,15.72 47.37,15.72 45.59,17.5 45.59,38.97 J18.1 38.1,46.47 J19.2
20-
  Top 0.254: F20.2 91.29,47.73 96.77,53.21 96.77,68.68 92.08,73.38 57.4,73.38 48.9,81.89 35.05,81.89 33.4,80.24 33.4,71.89 J20.2 38.1,57.83 J19.1
21+
  Top 0.254: F22.2 64.87,47.73 71.5,54.36 71.5,67.41 66.17,72.75 53.34,72.75 44.7,81.38 38.61,81.38 38.1,80.87 38.1,80.34 39.89,78.55 J21.1
21-
  Top 0.254: F21.2 87.35,41.43 93.09,35.69 93.09,21.82 87.63,16.36 48.01,16.36 46.99,17.37 46.99,60.3 J20.1 38.1,69.19 J21.2
+3V3
  Top 0.254: C5.1 C6.2 360.75,26.81 U1.8 | U1.7 U1.6 359.91,23.84 359.03,22.96 359.03,22.2 359.89,21.34 U1.1 361.45,21.34 R33.2 R32.2 365.51,11.53 A1.3.3V | U1.7 U1.8 | U1.12 358.64,23.34 359.64,24.34 U1.7 | U1.8 U1.9
GND  (via drill 0.38)  (6 unrouted)
  Top 0.254: R2.2 v354.46,16.48 | C6.1 v357,26.9 | C5.2 v357,29.18 | v353.06,36.8 C1.2 | U1.14 U1.13
  pour Bottom: 332.74,42.01 332.74,1.37 386.08,1.37 386.08,42.01
IM
  Top 0.254: U1.10 355.87,24.34 354.71,25.5 354.71,27.3 350.43,31.58 T1.10
IP  (via drill 0.38)
  Top 0.254: U1.11 355.61,23.84 351.41,28.04 v351.41,29.31 | v351.28,34.39 350.34,35.34 349.31,35.34 T1.12
  Bottom 0.254: v351.41,29.31 351.41,34.26 v351.28,34.39
N$1
  Top 0.254: F1.1 319.1,49.2 320.42,50.52 323.98,50.52 325.63,52.17 325.63,61.82 322.68,64.77 J22.1
N$2
  Top 0.254: F2.1 302.97,47.73 297.43,53.26 297.43,65.51 303.15,71.22 306.07,71.22 308.61,68.68 308.61,67.41 307.34,66.14 307.34,65.56 J23.1
N$3
  Top 0.254: F3.1 298.02,41.43 292.61,36.02 292.61,23.72 298.2,18.14 301.24,18.14 303.53,20.42 303.53,23.9 J24.1
N$4
  Top 0.254: J25.1 283.4,64.68 283.21,64.87 283.21,69.95 281.94,71.22 278.51,71.22 273.18,65.89 273.18,52.88 278.33,47.73 F4.1
N$5
  Top 0.254: F5.1 274.4,41.43 268.99,36.02 268.99,23.6 274.19,18.39 277.37,18.39 279.4,20.42 279.4,24.36 J26.1
N$6
  Top 0.254: F6.1 253.7,47.73 248.28,53.14 248.28,65.63 253.87,71.22 256.54,71.22 259.08,68.68 259.08,65 J27.1
N$7
  Top 0.254: F7.1 249.76,41.43 243.97,35.63 243.97,23.98 249.81,18.14 251.71,18.14 255.27,21.69 255.27,23.9 J28.1
N$8
  Top 0.254: F8.1 229.06,47.73 223.77,53.01 223.77,65.76 229.24,71.22 232.41,71.22 233.68,69.95 233.68,65.3 J29.1
N$9
  Top 0.254: F9.1 224.99,41.43 219.46,35.89 219.46,23.6 224.92,18.14 228.85,18.14 230.15,19.43 J30.1
N$10
  Top 0.254: F10.1 204.55,47.73 198.75,53.52 198.75,65.51 204.47,71.22 205.74,71.22 207.01,69.95 207.01,67.34 J31.1
N$11
  Top 0.254: F11.1 200.36,41.43 195.07,36.14 195.07,23.47 200.28,18.26 203.58,18.26 205.74,20.42 205.74,24.16 J32.1
N$12
  Top 0.254: F12.1 179.78,47.73 174.24,53.26 174.24,65.51 179.96,71.22 182.88,71.22 185.42,68.68 185.42,64.87 185.04,64.87 J33.1
N$13
  Top 0.254: F13.1 175.72,41.43 170.18,35.89 170.18,23.6 175.39,18.39 178.31,18.39 180.87,20.95 J34.1
N$14
  Top 0.254: J35.1 160.02,64.74 160.02,68.68 157.48,71.22 154.94,71.22 149.1,65.38 149.1,53.52 154.89,47.73 F14.1
N$15
  Top 0.254: J36.1 156.46,24.16 156.21,23.9 156.21,20.42 154.18,18.39 150.75,18.39 145.8,23.34 145.8,36.14 151.08,41.43 F15.1
N$16
  Top 0.254: F16.1 130.25,47.73 124.46,53.52 124.46,65.25 130.43,71.22 133.35,71.22 135.89,68.68 135.89,65.25 J37.1
N$17
  Top 0.254: F17.1 126.57,41.43 121.03,35.89 121.03,23.47 126.24,18.26 127.38,18.26 131.6,22.48 J38.1
N$18
  Top 0.254: F18.1 105.61,47.73 100.08,53.26 100.08,65.51 105.79,71.22 107.95,71.22 110.49,68.68 110.49,64.87 110.68,64.68 J39.1
N$19
  Top 0.254: J40.1 106.83,24.38 106.83,20.57 104.65,18.39 101.6,18.39 96.65,23.34 96.65,36.14 101.93,41.43 F19.1
N$20
  Top 0.254: F20.1 80.98,47.73 76.2,52.5 76.2,66.4 81.03,71.22 83.82,71.22 85.09,69.95 85.09,65.81 J41.1 | J41.1 86.36,64.54 86.36,63.6 86.13,63.83 J41.1
N$21
  Top 0.254: F21.1 77.17,41.43 71.5,35.76 71.5,23.98 77.22,18.26 80.39,18.26 82.55,20.42 82.55,24.16 J42.1
N$22
  Top 0.152: 59.69,64.8 J43.1
  Top 0.254: F22.1 54.61,47.73 50.42,51.92 50.42,67.03 54.61,71.22 57.15,71.22 59.69,68.68 59.69,64.8
N$23
  Top 0.254: T1.11 353.02,33.47 C1.1
N$24
  Top 0.254: U1.4 369.57,22.84 370.2,23.47 370.2,36.17 369.44,36.93 A1.D13
N$25
  Top 0.254: A1.D12 385.32,34.9 385.32,31.85 384.05,30.58 379.73,30.58 369.8,20.65 367.62,20.65 366.87,21.4 R32.1 364.57,22.34 U1.3
N$26
  Top 0.254: U1.2 362.65,21.84 R33.1 363.94,20.55 366.14,20.55 366.65,20.04 366.65,18.26 367.16,17.75 370.84,17.75 381.13,28.04 383.67,28.04 385.83,30.2 385.83,38.33 385.06,39.09 382.52,39.09 381.38,37.95 381.38,36.3 A1.D11
N$27
  Top 0.254: U1.5 365.4,23.34 366.01,23.95 366.01,38.96 366.78,39.73 379.98,39.73 380.62,39.09 380.62,34.77 383.29,32.11 A1.D10
N$30
  Top 0.254: U1.16 356.65,21.23 R25.1
N$31
  Top 0.254: R2.1 358.23,18.77 R25.2 358.36,21.1 357.61,21.84 U1.15
TD+
  Top 0.254: T1.1 334.01,35.36 332.87,34.22 332.87,15.85 340.13,8.58 J44.1 340.13,6.32 341.78,4.67 344.04,4.67 344.68,5.31 344.68,10.86 R1.2 342.48,13.52 TD+.1
TD-
  Top 0.254: J44.2 343.13,6.48 340.74,8.86 | 340.74,8.86 333.41,16.19 333.41,30.96 334.04,31.58 T1.3 | TD-.1 340.78,14.54 R1.1 340.78,8.9 340.74,8.86

### Text on the board
tPlace: AMS Test Board Rev 2 / HyTech Racing 2023 / Designed by Ethan Su